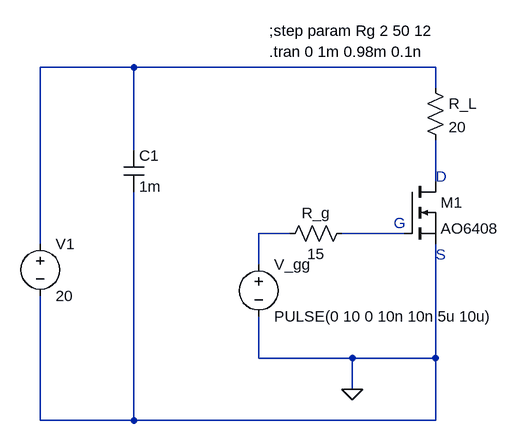
[diagram p0: schematic task1_model1.asc]
task1_model1.asc, the LTspice schematic file:
Version 4
SHEET 1 880 680
WIRE -112 -64 -256 -64
WIRE 352 -64 -112 -64
WIRE 352 -32 352 -64
WIRE -112 64 -112 -64
WIRE 352 112 352 48
WIRE 128 192 80 192
WIRE 304 192 208 192
WIRE -256 208 -256 -64
WIRE 80 240 80 192
WIRE 80 384 80 320
WIRE 224 384 80 384
WIRE 352 384 352 208
WIRE 352 384 224 384
WIRE 224 432 224 384
WIRE -256 480 -256 288
WIRE -112 480 -112 128
WIRE -112 480 -256 480
WIRE 352 480 352 384
WIRE 352 480 -112 480
FLAG 224 432 0
SYMBOL voltage 80 224 R0
WINDOW 123 0 0 Left 0
WINDOW 39 0 0 Left 0
SYMATTR InstName V_gg
SYMATTR Value PULSE(0 10 0 10n 10n 5u 10u)
SYMBOL nmos 304 112 R0
SYMATTR InstName M1
SYMATTR Value AO6408
SYMBOL res 224 176 R90
WINDOW 0 0 56 VBottom 2
WINDOW 3 32 56 VTop 2
SYMATTR InstName R_g
SYMATTR Value 15
SYMBOL res 336 -48 R0
SYMATTR InstName R_L
SYMATTR Value 20
SYMBOL cap -128 64 R0
SYMATTR InstName C1
SYMATTR Value 1m
SYMBOL voltage -256 192 R0
WINDOW 123 0 0 Left 0
WINDOW 39 0 0 Left 0
SYMATTR InstName V1
SYMATTR Value 20
TEXT 288 176 Left 2 ;G
TEXT 352 104 Left 2 ;D
TEXT 352 224 Left 2 ;S
TEXT 96 -88 Left 2 !.tran 0 1m 0.98m 0.1n
TEXT 96 -120 Left 2 !;step param Rg 2 50 12

The netlist it stands for:
* task1_model1.asc
V_gg N003 0 PULSE(0 10 0 10n 10n 5u 10u)
M1 N002 N004 0 0 AO6408
R_g N004 N003 15
R_L N001 N002 20
C1 N001 0 1m
V1 N001 0 20
.model NMOS NMOS
.model PMOS PMOS
.lib standard.mos
* G
* D
* S
.tran 0 1m 0.98m 0.1n
;step param Rg 2 50 12
.backanno
.end